# Altium schematic sheet 2V_REG.SchDoc
size A4; SheetNumber: 10; SheetTotal: 19
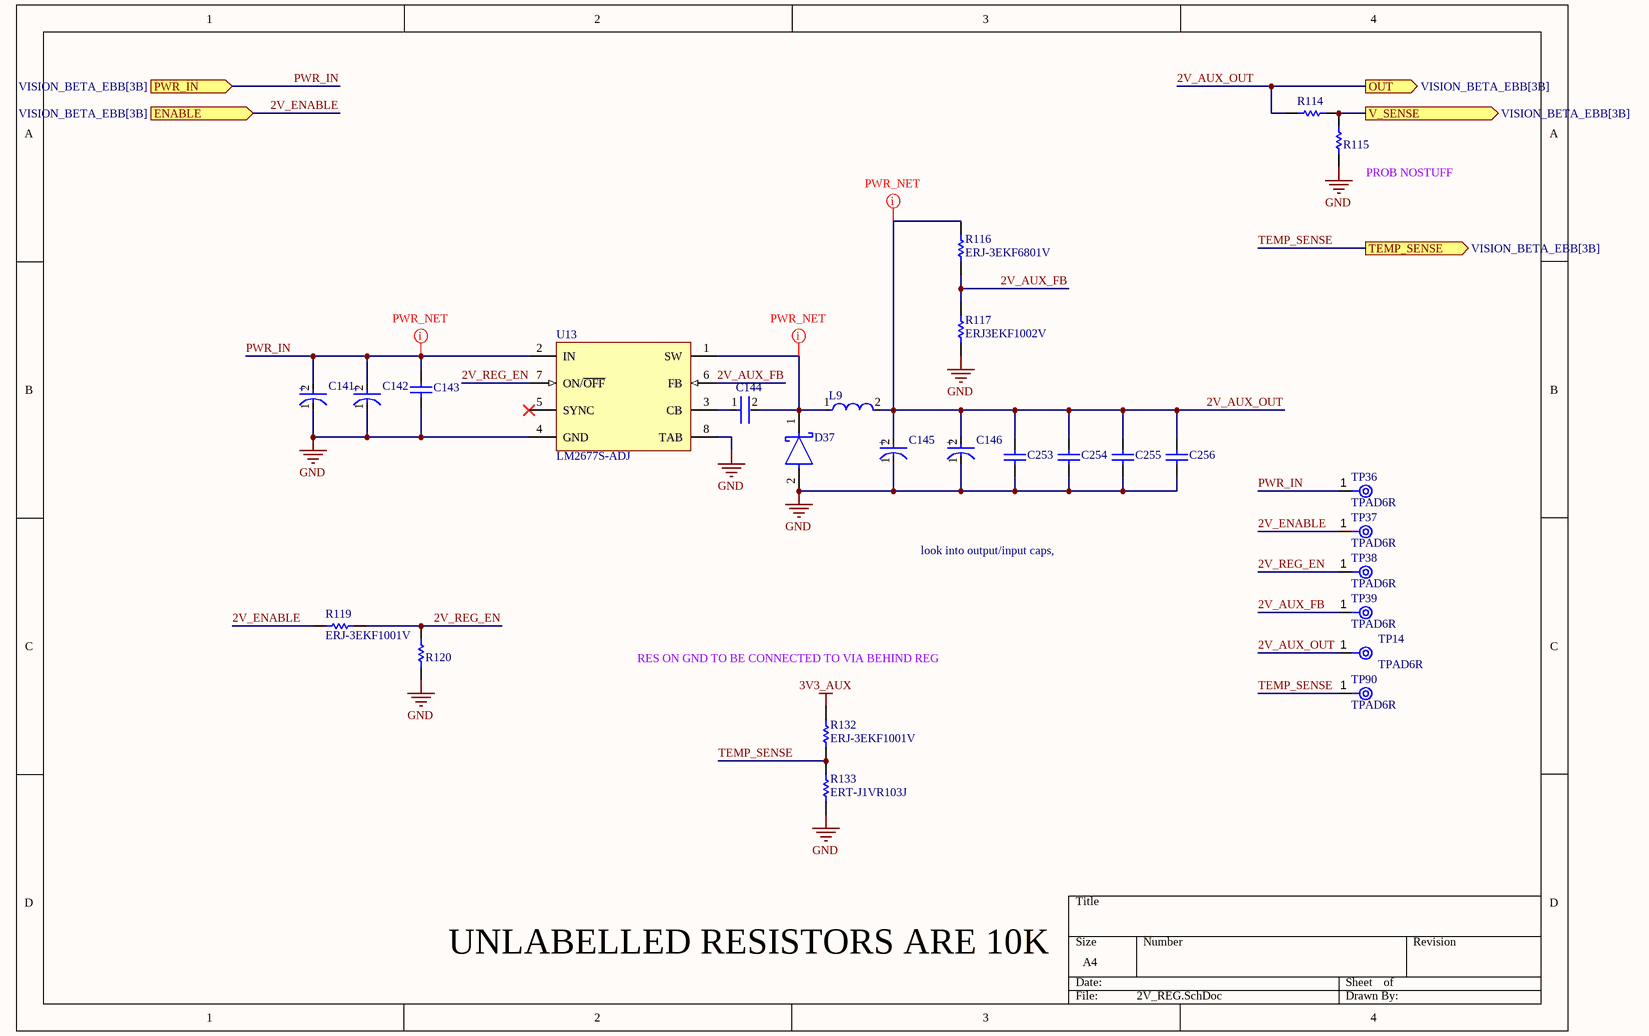
[diagram p0: 2V_REG.SchDoc]

## Parts
C141  EEHZA1V680XP  [FP-EEH-D8-MFG]  (value not drawn)
C142  EEHZA1V680XP  [FP-EEH-D8-MFG]  (value not drawn)
C143  CAP 470nF 50V 1812(4532)  [CAPC1812(4532)125_M]  (value not drawn)
C144  C0805C103J5RACTU  [FP-C0805C-DN-MFG]  (value not drawn)
C145  16SVPC120M  [FP-OS-CON-SMT-E7-MFG]  (value not drawn)
C146  16SVPC120M  [FP-OS-CON-SMT-E7-MFG]  (value not drawn)
C253  CAP 470nF 50V 1812(4532)  [CAPC1812(4532)125_M]  (value not drawn)
C254  CAP 470nF 50V 1812(4532)  [CAPC1812(4532)125_M]  (value not drawn)
C255  CAP 470nF 50V 1812(4532)  [CAPC1812(4532)125_M]  (value not drawn)
C256  CAP 470nF 50V 1812(4532)  [CAPC1812(4532)125_M]  (value not drawn)
D37  B540C-13-F  [FP-SMC-MFG]  (value not drawn)
L9  SRR1260-150M  [FP-SRR1260-MFG]  (value not drawn)
R114  ERJ3EKF1002V  [RESC1609X55X30LL15T15]  (value not drawn)
R115  ERJ3EKF1002V  [RESC1609X55X30LL15T15]  (value not drawn)
R116  ERJ-3EKF6801V  [RESC1609X55X30NL15T15]
R117  ERJ3EKF1002V  [RESC1609X55X30LL15T15]
R119  ERJ-3EKF1001V  [RESC1608X55X30LL15T15]
R120  ERJ3EKF1002V  [RESC1609X55X30LL15T15]  (value not drawn)
R132  ERJ-3EKF1001V  [RESC1608X55X30LL15T15]
R133  ERT-J1VR103J  [RESC1608X90X30ML15T20]
TP14  TPAD6R  [New footprint 1]
TP36  TPAD6R  [New footprint 1]
TP37  TPAD6R  [New footprint 1]
TP38  TPAD6R  [New footprint 1]
TP39  TPAD6R  [New footprint 1]
TP90  TPAD6R  [New footprint 1]
U13  LM2677S-ADJ  [KTW0007B_M]

## Ports
ENABLE (in, see VISION_BETA_EBB[3B]), OUT (out, see VISION_BETA_EBB[3B]), PWR_IN (in, see VISION_BETA_EBB[3B]), TEMP_SENSE (out, see VISION_BETA_EBB[3B]), V_SENSE (out, see VISION_BETA_EBB[3B])

## Nets
3V3_AUX: R132.2
GND: C141.1(C) C142.1(C) C143.1 C145.1(C) C146.1(C) C253.1 C254.1 C255.1 C256.1 D37.2(A) R115.1 R117.1 R120.1 R133.1 U13.4(GND) U13.8(TAB)
2V_AUX_FB: R116.1 R117.2 TP39.1(TP) U13.6(FB)
2V_AUX_OUT: C145.2(A) C146.2(A) C253.2 C254.2 C255.2 C256.2 L9.2 R114.1 R116.2 TP14.1(TP) ; port OUT
2V_ENABLE: R119.1 TP37.1(TP) ; port ENABLE
2V_REG_EN: R119.2 R120.2 TP38.1(TP) U13.7(ON/~{OFF})
PWR_IN: C141.2(A) C142.2(A) C143.2 TP36.1(TP) U13.2(IN) ; port PWR_IN
TEMP_SENSE: R132.1 R133.2 TP90.1(TP) ; port TEMP_SENSE
V_SENSE: R114.2 R115.2 ; port V_SENSE
NetC144_1: C144.1 U13.3(CB)
NetC144_2: C144.2 D37.1(C) L9.1 U13.1(SW)

Not connected (* = marked no-connect by the designer): U13 5(SYNC)*

## Layout directives
net class PWR: 2V_AUX_OUT, NetC144_2, PWR_IN

## Notes on the sheet
- (near R115) PROB NOSTUFF
- look into output/input caps,
- RES ON GND TO BE CONNECTED TO VIA BEHIND REG
- UNLABELLED RESISTORS ARE 10K
- (in symbol CMP-05428-000021-2) +
- (in symbol CMP-05428-001211-1) +

## Library data of the parts
C141 C142 = CMP-05428-001211-1: Conductive Polymer Hybrid Aluminum Electrolytic Capacitors 68uF ±20% 35V RADIAL SMT 6.3x7.7mm; Leakage Current: 23.8uA; Ripple Current (AC): 2A; Polarity: Polar; Life (Hours): 5000Hour; ESR (Equivalent Series Resistance): 35mR; Lead Diameter: 0.65mm; Termination: SMD/SMT; Case/Package: Radial; Package Quantity: 900; Radiation Hardening: No; Max Operating Temperature: 105°C; Capacitance: 68uF; Voltage Rating: 35V; Number of Pins: 8; Mount: Surface Mount; Technology: HYBRID; Diameter: 6.3mm; Min Operating Temperature: -55°C; Length: 7.7mm; Ratings: AEC-Q200; Height - Seated (Max): 0.315inch; Ripple Current: 2A; Lead Free: Lead Free; Voltage: 35V; Lead Pitch: 1.8mm; Voltage Rating (DC): 35V; REACH SVHC: No SVHC; Material: Polymer; Height: 7.7mm; Tolerance: 20%; Construction: Cylindrical; Packaging: Tape and Reel; Series: ZA
C143 C253-C256 = CMP-1040-01539-1: CAP 470nF 50V ±10% 1812 (4532 Metric) Thickness 1.25mm SMD; Tolerance: Â±10%; Case-Metric: 4532; Case-EIA: 1812; Technology: SMT; Max Thickness: 1.25 mm; Value: 470nF; Rated Voltage: 50 V
C144 = CMP-2007-00254-2: CAP CER 10000PF 50V X7R 0805; Manufacturer: KEMET; Value: 10,000 pF; Material: Ceramic; Temperature Coefficient: 30ppm/°C; Tolerance: 0.05; Device Class L1: Passive Components; Temperature: -55°C to +125°C; Lead Free: Yes; ComponentLink2URL: https://content.kemet.com/datasheets/KEM_C1003_C0G_SMD.pdf; Device Class L3: Ceramic Capacitors; Temperature Characteristic: X7R; Temperature Range High: +125°C; Mouser Description: Capacitor; Ceramic; Cap 0.01uF; Tol 5%; Vol-Rtg 50 V; SMT; Case 0805; X7R; TR; ComponentLink2Description: Datasheet; Manufacturer Part Number: C0805C103J5RACTU; Height: 0.88mm; Digikey Description: CAP CER 10000PF 50V X7R 0805; Capacitance: 10,000 pF; Temperature Range Low: -55°C; Device Class L2: Capacitors; Octopart: https://octopart.com/c0805c103j5ractu-kemet-133473; Voltage Rating: 50 V; Category: Cap; RoHS: TRUE; Automotive: No; Package: C0805C-DN; Ipc Land Pattern Name: CAPC200125X78
C145 C146 = CMP-05428-000021-2: Conductive Polymer Aluminum Solid Capacitors (OS-CON) 120uF ±20% 16V RADIAL SMT 8x6.9mm; Leakage Current: 500uA; Ripple Current: 2.9A; ESR (Equivalent Series Resistance): 27mR; Polarity: Polar; Dissipation Factor: 12%; Life (Hours): 2000Hour; Lead Free: Lead Free; Voltage Rating (DC): 16V; Min Operating Temperature: -55°C; Height - Seated (Max): 0.276inch; Case/Package: Radial; REACH SVHC: No SVHC; Diameter: 8mm; Mount: Surface Mount; Package Quantity: 1000; Construction: Cylindrical; Max Operating Temperature: 105°C; Capacitance: 120uF; Voltage: 16V; Length: 6.9mm; Tolerance: 20%; RoHS Compliant: Yes; Series: OS-CON, SVPC; Packaging: Tape and Reel; Voltage Rating: 16V; Termination: SMD/SMT; Number of Pins: 7; Ripple Current (AC): 2.9A; Height: 6.9mm
D37 = CMP-2000-05097-3: DIODE SCHOTTKY 40V 5A SMC; Manufacturer: Diodes Inc.; Automotive Grade: NA; Peak Reverse Current: 0.5mA; Value: 300pF; Max Junction Temp: +150°C; Max Surge Forward Current: 100A; Standoff Height: 0.1mm; Digikey Description: DIODE SCHOTTKY 40V 5A SMC; Temperature Range Low: -55°C; Manufacturer Part Number: B540C-13-F; Octopart: https://octopart.com/b540c-13-f-diodes+inc.-325873; Lead Free: Yes; Reverse Voltage: 40V; RoHS: TRUE; Category: Diode; Mouser Description: Diode: Schottky rectifying; SMD; 40V; 5A; SMC; Package: reel, tape; ComponentLink2Description: Datasheet; Temperature Range High: +150°C; Automotive: No; Footprint Url: https://www.diodes.com/assets/Package-Files/SMC.pdf; Device Class L3: Schottky Diodes; Height: 2.5mm; Forward Current: 5A; Temperature: -55°C to +150°C; Package: SMC; ComponentLink2URL: https://www.diodes.com/assets/Datasheets/ds13012.pdf; Device Class L2: Diodes; Max Repetitive Reverse Voltage: 40V; Device Class L1: Discrete Semiconductors; Capacitance: 300pF
L9 = CMP-2000-07146-2: FIXED IND 15UH 5A 27 MOHM SMD; Q Factor: 25; Sample Rate (Hz): 100kHz; Resistance: 27MR; Material: Steel; Inductance Tolerance: 20%; Frequency: 17.6MHz; Saturation Current: 4.6A; Core Material: Ferrite; Shielding: Shielded; Series: SRR1260; Termination: SMD/SMT; Packaging: Tape and Reel; RoHS Compliant: Yes; Height - Seated (Max): 0.256inch; Depth: 12.8mm; Case/Package: 1260; Inductance: 15uH; Height: 6mm; Number of Pins: 2; Mount: Surface Mount; Min Operating Temperature: -40°C; Test Frequency: 100kHz; Length: 12.5mm; Self Resonant Frequency: 17.6MHz; Current Rating: 5A; Tolerance: 20%; RMS Current (Irms): 5A; REACH SVHC: No SVHC; Resistor Type: Wirewound; DC Resistance (DCR): 27mR; Width: 12.5mm; Package Quantity: 600; DC Current: 5A; Max DC Current: 5A; Max Operating Temperature: 125°C; Military Standard: Not
R114 R115 R117 R120 = CMP-1012-00623-3: Chip Resistor, 10 KOhm, +/- 1%, 0.1 W, -55 to 155 degC, 0603 (1608 Metric), RoHS, Tape and Reel; Manufacturer: Panasonic; Voltage Rating: 75V; Case\/Package: 0603; Power Rating: 100mW; Resistance: 10KOhm; Temperature Coefficient: 100ppm\/degreesC; Number of Pins: 2; Package Reference: 603; Depth: 0.8mm; Mount: SurfaceMount; Package Description: 2-Pin Surface Mount Device, Body 1.6 x 0.85 mm; Datasheet Version: 02/2017; Length: 1.6mm; Lead Free: LeadFree; Height: 0.45mm; Number of Terminations: 2; Max Power Dissipation: 100mW; Min Operating Temperature: -55degC; Datasheet URL: https://industrial.panasonic.com/cdbs/www-data/pdf/RDA0000/AOA0000C304.pdf; Termination: SMD/SMT; Case Code (Metric): 1608; Case Code (Imperial): 0603; Tolerance: 1%; Max Operating Temperature: 155degC; RoHSCompliant: true; Voltage Rating (DC): 75V; Radiation Hardening: No; Packaging: TapeandReel; Composition: ThickFilm; Mounting Technology: SurfaceMount; Manufacturer URL: http://www.panasonic.com/; Width: 0.031inch; REACH SVHC: NoSVHC; Contact Plating: Tin; Military Standard: Not; Package Quantity: 1
R116 = CMP-1012-00604-3: Chip Resistor, 6.8 KOhm, +/- 1%, 0.1 W, -55 to 155 degC, 0603 (1608 Metric), RoHS, Tape and Reel; Frequency: 48 MHz; Min Supply Voltage: 1.71 V; I\Os: 50; Max Supply Voltage: 3.6 V; Interface: UART; Density: 128 KB; RAM Size: 16 KB; PWM Channels: 6; ADC Channels: 14; Case\Package: LQFP; PackageDescription: 2-Pin Surface Mount Device, Body 1.6 x 0.85 mm; Max Operating Temperature: 105 degC; Package Quantity: 160; ComponentLink2Description: Datasheet; Max Clock Frequency: 48 MHz; ComponentLink1URL: http://www.panasonic.com/; REACH SVHC: No SVHC; Min Operating Temperature: -40 degC; Weight: 0.012224 oz; ComponentLink2URL: http://industrial.panasonic.com/cdbs/www-data/pdf/RDA0000/AOA0000C86.pdf; ComponentLink1Description: Manufacturer URL; Pins: 64; DatasheetVersion: Apr-15; RoHSCompliant: true; PackageReference: 0603; Packaging: Tray; Length: 10 mm; Radiation Hardening: No; Mount: Surface Mount; Width: 10 mm; Height: 1.45 mm
R119 R132 = CMP-2000-00180-1: Manufacturer: Panasonic; Part Number: ERJ-3EKF1001V
R133 = CMP-2000-00869-1: Manufacturer: Panasonic; Part Number: ERT-J1VR103J
TP14 TP36-TP39 TP90 = CMP-00025-2: Test Point .6mm
U13 = CMP-0069-00211-3: SIMPLE SWITCHER® High Efficiency 5A Step-Down Voltage Regulator with Sync, 7-pin TO-263; Manufacturer: Texas Instruments; PackageTopMarking: NSUZXYTTE#*LM2677S*-ADJ; PowerWise: N; PinCount: 7; CompType: Switcher; ComponentLink1Description: Datasheet URL; PackageReference: KTW0007B; Code_JEDEC: MO-169-AC; ComponentLink1URL: http://www.ti.com/general/docs/lit/getliterature.tsp?genericPartNumber=LM2677&fileType=pdf; PackageDescription: TO-263, Molded, .400 x .390 x .180in Body, 7 Lead, .050in Pitch, Surface Mount; RoHS: N